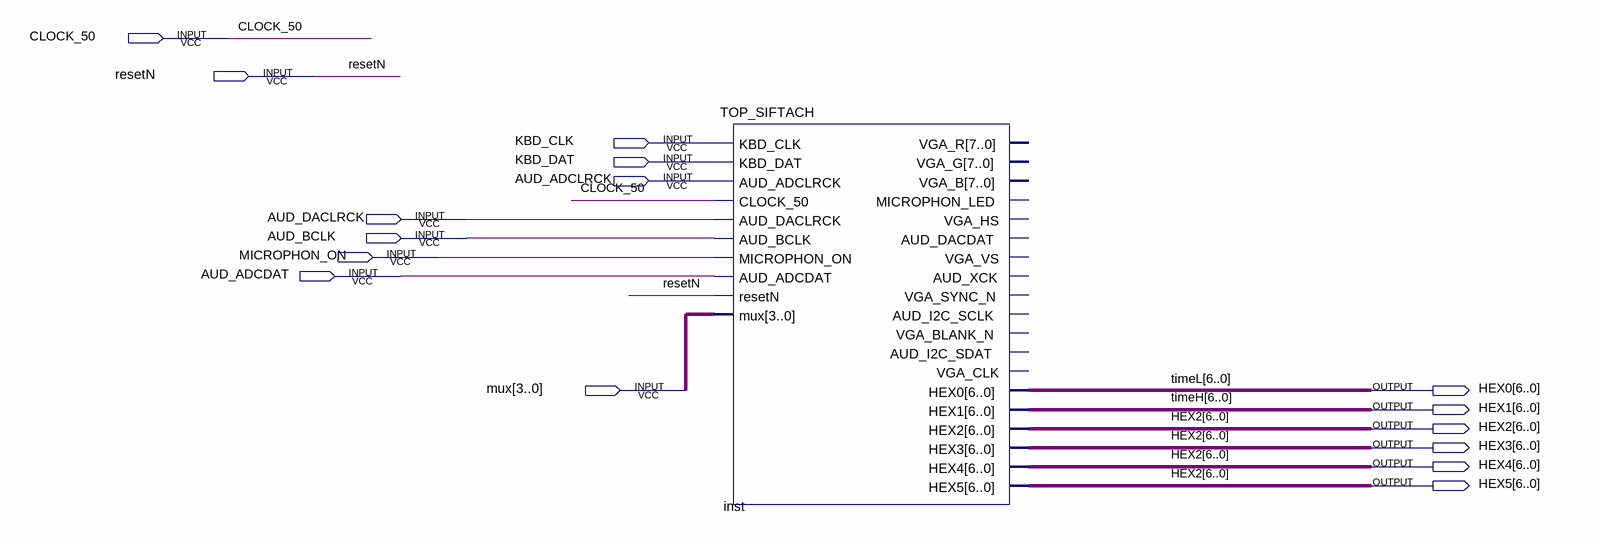
[diagram p0: schematic sheet]
// Quartus schematic top_siftach_parser.bdf as structural Verilog: 1 symbols, 16 pins
module top_siftach_parser (
  input  CLOCK_50,
  input  resetN,
  input  KBD_CLK,
  input  KBD_DAT,
  input  AUD_ADCLRCK,
  input  AUD_DACLRCK,
  input  AUD_BCLK,
  input  MICROPHON_ON,
  input  AUD_ADCDAT,
  input  [3:0] mux,
  output [6:0] HEX0,
  output [6:0] HEX1,
  output [6:0] HEX2,
  output [6:0] HEX3,
  output [6:0] HEX4,
  output [6:0] HEX5
);

  TOP_SIFTACH inst (
    .KBD_CLK(KBD_CLK), .KBD_DAT(KBD_DAT), .AUD_ADCLRCK(AUD_ADCLRCK), .CLOCK_50(CLOCK_50),
    .AUD_DACLRCK(AUD_DACLRCK), .AUD_BCLK(AUD_BCLK), .MICROPHON_ON(MICROPHON_ON), .AUD_ADCDAT(AUD_ADCDAT),
    .resetN(resetN), .mux(mux), .HEX0(HEX0), .HEX1(HEX1), .HEX2(HEX2), .HEX3(HEX2), .HEX4(HEX2), .HEX5(HEX2));  // open: VGA_R, VGA_G, VGA_B, MICROPHON_LED, VGA_HS, AUD_DACDAT, VGA_VS, AUD_XCK, VGA_SYNC_N, AUD_I2C_SCLK, VGA_BLANK_N, VGA_CLK, AUD_I2C_SDAT

  assign HEX3 = HEX2;
  assign HEX4 = HEX2;
  assign HEX5 = HEX2;

  // Other names for the same wires on the sheet: timeH[6:0] = HEX1; timeL[6:0] = HEX0
endmodule
